# EAGLE design PhasedArrayReceiver (EAGLE 9.5.2)
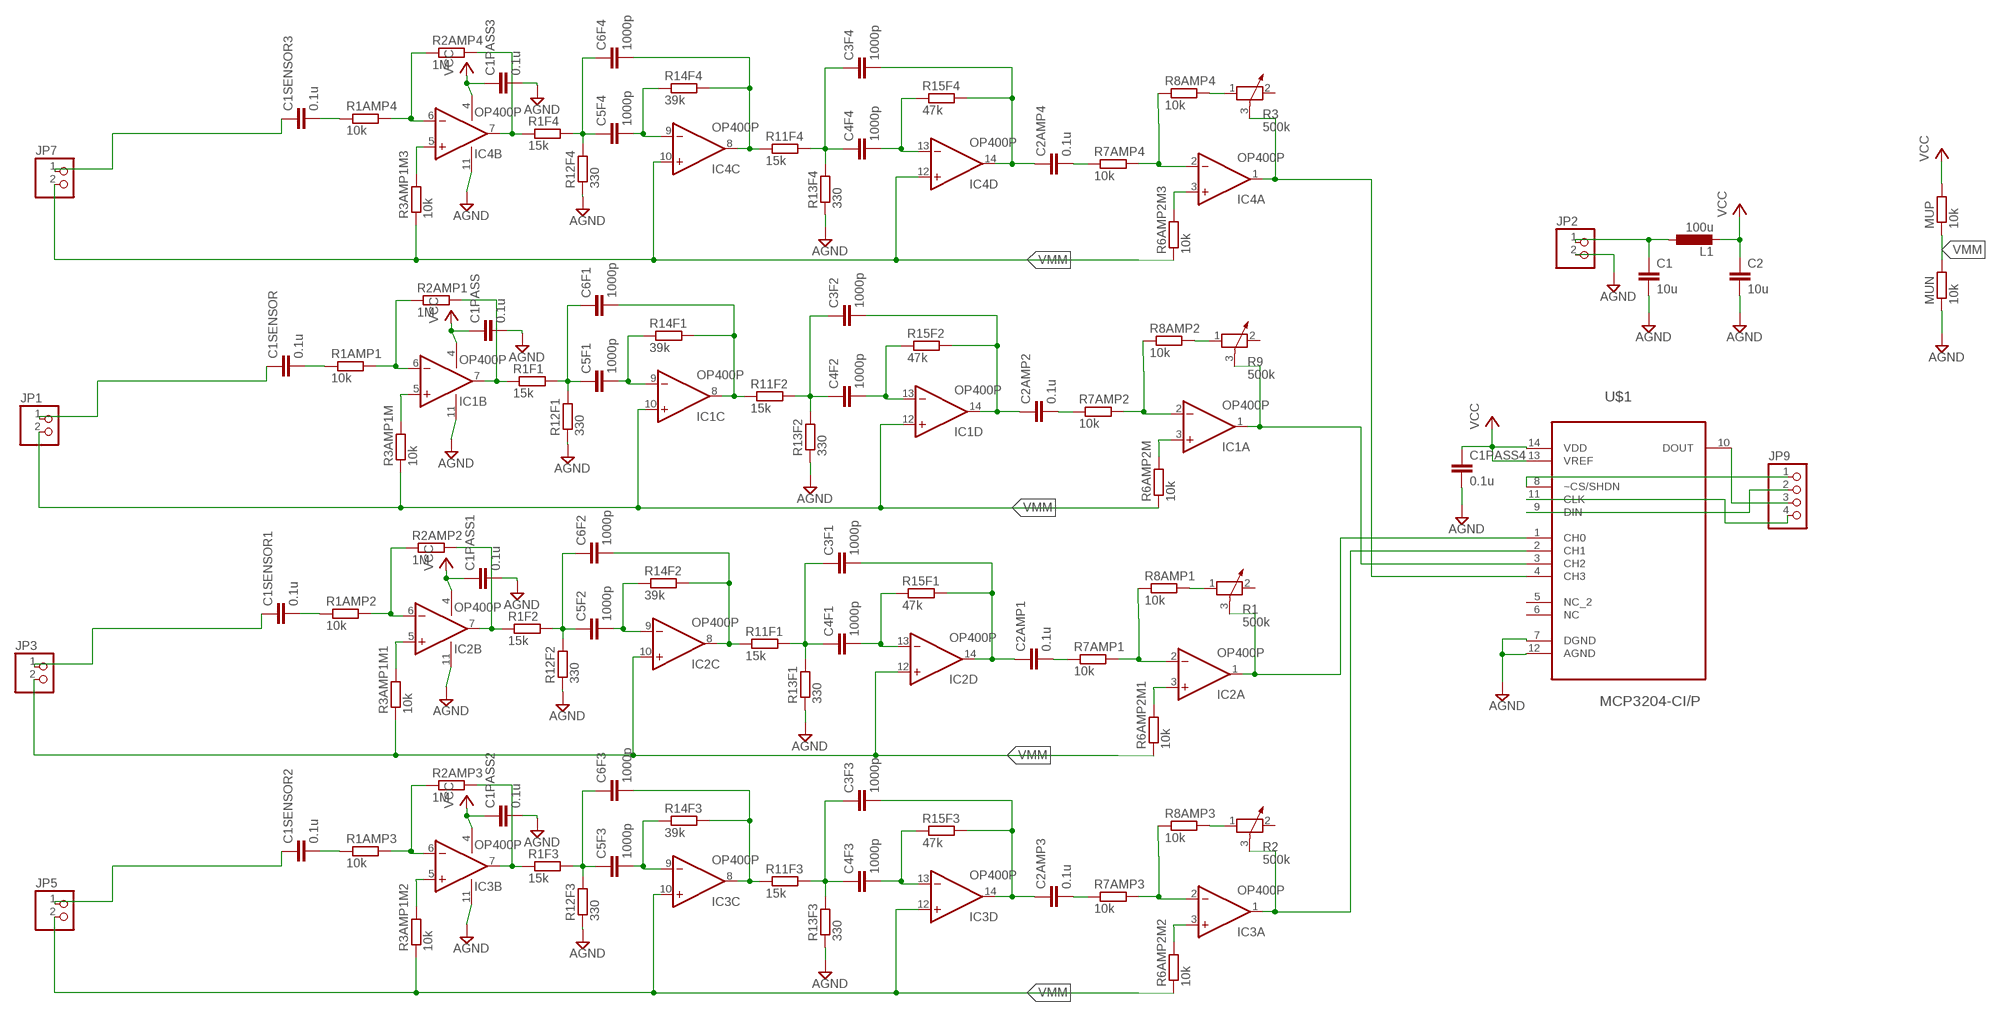
[diagram p0: schematic, sheet 1]

## Parts
C1  10u  C-EU025-024X044  [C025-024X044]
C1PASS  0.1u  C-EU025-024X044  [C025-024X044]
C1PASS1  0.1u  C-EU025-024X044  [C025-024X044]
C1PASS2  0.1u  C-EU025-024X044  [C025-024X044]
C1PASS3  0.1u  C-EU025-024X044  [C025-024X044]
C1PASS4  0.1u  C-EU025-024X044  [C025-024X044]
C1SENSOR  0.1u  C-EUC0603K  [C0603K]
C1SENSOR1  0.1u  C-EUC0603K  [C0603K]
C1SENSOR2  0.1u  C-EUC0603K  [C0603K]
C1SENSOR3  0.1u  C-EUC0603K  [C0603K]
C2  10u  C-EU025-024X044  [C025-024X044]
C2AMP1  0.1u  C-EUC0603K  [C0603K]
C2AMP2  0.1u  C-EUC0603K  [C0603K]
C2AMP3  0.1u  C-EUC0603K  [C0603K]
C2AMP4  0.1u  C-EUC0603K  [C0603K]
C3F1  1000p  C-EUC0603K  [C0603K]
C3F2  1000p  C-EUC0603K  [C0603K]
C3F3  1000p  C-EUC0603K  [C0603K]
C3F4  1000p  C-EUC0603K  [C0603K]
C4F1  1000p  C-EUC0603K  [C0603K]
C4F2  1000p  C-EUC0603K  [C0603K]
C4F3  1000p  C-EUC0603K  [C0603K]
C4F4  1000p  C-EUC0603K  [C0603K]
C5F1  1000p  C-EUC0603K  [C0603K]
C5F2  1000p  C-EUC0603K  [C0603K]
C5F3  1000p  C-EUC0603K  [C0603K]
C5F4  1000p  C-EUC0603K  [C0603K]
C6F1  1000p  C-EUC0603K  [C0603K]
C6F2  1000p  C-EUC0603K  [C0603K]
C6F3  1000p  C-EUC0603K  [C0603K]
C6F4  1000p  C-EUC0603K  [C0603K]
IC1  OP400P  [DIL14]
IC2  OP400P  [DIL14]
IC3  OP400P  [DIL14]
IC4  OP400P  [DIL14]
JP1  PINHD-1X2  [1X02]
JP2  PINHD-1X2  [1X02]
JP3  PINHD-1X2  [1X02]
JP5  PINHD-1X2  [1X02]
JP7  PINHD-1X2  [1X02]
JP9  PINHD-1X4  [1X04]
L1  100u  L-EU0207/7  [0207/7]
MUN  10k  R-EU_0207/7  [0207/7]
MUP  10k  R-EU_0207/7  [0207/7]
R1  500k  POTENTIOMETER_PT-10  [PT-10]
R1AMP1  10k  R-EU_R0603  [R0603]
R1AMP2  10k  R-EU_R0603  [R0603]
R1AMP3  10k  R-EU_R0603  [R0603]
R1AMP4  10k  R-EU_R0603  [R0603]
R1F1  15k  R-EU_0207/7  [0207/7]
R1F2  15k  R-EU_0207/7  [0207/7]
R1F3  15k  R-EU_0207/7  [0207/7]
R1F4  15k  R-EU_0207/7  [0207/7]
R2  500k  POTENTIOMETER_PT-10  [PT-10]
R2AMP1  1M  R-EU_R0603  [R0603]
R2AMP2  1M  R-EU_R0603  [R0603]
R2AMP3  1M  R-EU_R0603  [R0603]
R2AMP4  1M  R-EU_R0603  [R0603]
R3  500k  POTENTIOMETER_PT-10  [PT-10]
R3AMP1M  10k  R-EU_R0603  [R0603]
R3AMP1M1  10k  R-EU_R0603  [R0603]
R3AMP1M2  10k  R-EU_R0603  [R0603]
R3AMP1M3  10k  R-EU_R0603  [R0603]
R6AMP2M  10k  R-EU_R0603  [R0603]
R6AMP2M1  10k  R-EU_R0603  [R0603]
R6AMP2M2  10k  R-EU_R0603  [R0603]
R6AMP2M3  10k  R-EU_R0603  [R0603]
R7AMP1  10k  R-EU_R0603  [R0603]
R7AMP2  10k  R-EU_R0603  [R0603]
R7AMP3  10k  R-EU_R0603  [R0603]
R7AMP4  10k  R-EU_R0603  [R0603]
R8AMP1  10k  R-EU_R0603  [R0603]
R8AMP2  10k  R-EU_R0603  [R0603]
R8AMP3  10k  R-EU_R0603  [R0603]
R8AMP4  10k  R-EU_R0603  [R0603]
R9  500k  POTENTIOMETER_PT-10  [PT-10]
R11F1  15k  R-EU_R0603  [R0603]
R11F2  15k  R-EU_R0603  [R0603]
R11F3  15k  R-EU_R0603  [R0603]
R11F4  15k  R-EU_R0603  [R0603]
R12F1  330  R-EU_R0603  [R0603]
R12F2  330  R-EU_R0603  [R0603]
R12F3  330  R-EU_R0603  [R0603]
R12F4  330  R-EU_R0603  [R0603]
R13F1  330  R-EU_R0603  [R0603]
R13F2  330  R-EU_R0603  [R0603]
R13F3  330  R-EU_R0603  [R0603]
R13F4  330  R-EU_R0603  [R0603]
R14F1  39k  R-EU_0207/7  [0207/7]
R14F2  39k  R-EU_0207/7  [0207/7]
R14F3  39k  R-EU_0207/7  [0207/7]
R14F4  39k  R-EU_0207/7  [0207/7]
R15F1  47k  R-EU_0207/7  [0207/7]
R15F2  47k  R-EU_0207/7  [0207/7]
R15F3  47k  R-EU_0207/7  [0207/7]
R15F4  47k  R-EU_0207/7  [0207/7]
U$1  MCP3204-CI/P  [DIP254P762X432-14]

## Nets
AGND [power]: C1.2 C1PASS1.2 C1PASS2.2 C1PASS3.2 C1PASS4.2 C1PASS.2 C2.2 IC1.11(P:V-) IC2.11(P:V-) IC3.11(P:V-) IC4.11(P:V-) JP2.2 MUN.1 R12F1.1 R12F2.1 R12F3.1 R12F4.1 R13F1.1 R13F2.1 R13F3.1 R13F4.1 U$1.7(DGND) U$1.12(AGND)
N$1: IC1.6(B:-IN) R1AMP1.2 R2AMP1.1
N$2: IC1.5(B:+IN) R3AMP1M.2
N$3: IC1.7(B:OUT) R1F1.1 R2AMP1.2
N$4: IC1.2(A:-IN) R7AMP2.2 R8AMP2.1
N$5: IC2.6(B:-IN) R1AMP2.2 R2AMP2.1
N$6: C1SENSOR.1 JP1.1
N$7: IC1.3(A:+IN) R6AMP2M.2
N$8: C1SENSOR.2 R1AMP1.1
N$9: C2AMP2.2 R7AMP2.1
N$10: R8AMP2.2 R9.1
N$11: IC1.1(A:OUT) R9.3 U$1.3(CH2)
N$12: C2AMP2.1 C3F2.2 IC1.14(D:OUT) R15F2.2
N$13: C5F1.2 IC1.9(C:-IN) R14F1.1
N$14: C4F2.2 IC1.13(D:-IN) R15F2.1
N$15: C3F2.1 C4F2.1 R11F2.2 R13F2.2
N$16: C6F1.2 IC1.8(C:OUT) R11F2.1 R14F1.2
N$17: C5F1.1 C6F1.1 R1F1.2 R12F1.2
N$18: IC2.7(B:OUT) R1F2.1 R2AMP2.2
N$19: IC2.2(A:-IN) R7AMP1.2 R8AMP1.1
N$20: IC2.3(A:+IN) R6AMP2M1.2
N$21: C1SENSOR1.2 R1AMP2.1
N$22: C2AMP1.2 R7AMP1.1
N$23: R1.1 R8AMP1.2
N$24: C2AMP1.1 C3F1.2 IC2.14(D:OUT) R15F1.2
N$25: C5F2.2 IC2.9(C:-IN) R14F2.1
N$26: C4F1.2 IC2.13(D:-IN) R15F1.1
N$27: C3F1.1 C4F1.1 R11F1.2 R13F1.2
N$28: C6F2.2 IC2.8(C:OUT) R11F1.1 R14F2.2
N$29: C5F2.1 C6F2.1 R1F2.2 R12F2.2
N$30: IC2.5(B:+IN) R3AMP1M1.2
N$31: C1SENSOR1.1 JP3.1
N$32: IC2.1(A:OUT) R1.3 U$1.1(CH0)
N$33: IC3.6(B:-IN) R1AMP3.2 R2AMP3.1
N$34: IC3.7(B:OUT) R1F3.1 R2AMP3.2
N$35: IC3.2(A:-IN) R7AMP3.2 R8AMP3.1
N$36: IC3.3(A:+IN) R6AMP2M2.2
N$37: C1SENSOR2.2 R1AMP3.1
N$38: C2AMP3.2 R7AMP3.1
N$39: R2.1 R8AMP3.2
N$40: C2AMP3.1 C3F3.2 IC3.14(D:OUT) R15F3.2
N$41: C5F3.2 IC3.9(C:-IN) R14F3.1
N$42: C4F3.2 IC3.13(D:-IN) R15F3.1
N$43: C3F3.1 C4F3.1 R11F3.2 R13F3.2
N$44: C6F3.2 IC3.8(C:OUT) R11F3.1 R14F3.2
N$45: C5F3.1 C6F3.1 R1F3.2 R12F3.2
N$46: IC3.5(B:+IN) R3AMP1M2.2
N$47: C1SENSOR2.1 JP5.1
N$48: IC3.1(A:OUT) R2.3 U$1.2(CH1)
N$49: IC4.6(B:-IN) R1AMP4.2 R2AMP4.1
N$50: IC4.7(B:OUT) R1F4.1 R2AMP4.2
N$51: IC4.2(A:-IN) R7AMP4.2 R8AMP4.1
N$52: IC4.3(A:+IN) R6AMP2M3.2
N$53: C1SENSOR3.2 R1AMP4.1
N$54: C2AMP4.2 R7AMP4.1
N$55: R3.1 R8AMP4.2
N$56: C2AMP4.1 C3F4.2 IC4.14(D:OUT) R15F4.2
N$57: C5F4.2 IC4.9(C:-IN) R14F4.1
N$58: C4F4.2 IC4.13(D:-IN) R15F4.1
N$59: C3F4.1 C4F4.1 R11F4.2 R13F4.2
N$60: C6F4.2 IC4.8(C:OUT) R11F4.1 R14F4.2
N$61: C5F4.1 C6F4.1 R1F4.2 R12F4.2
N$62: IC4.5(B:+IN) R3AMP1M3.2
N$63: C1SENSOR3.1 JP7.1
N$64: IC4.1(A:OUT) R3.3 U$1.4(CH3)
N$65: JP9.1 U$1.8(~CS/SHDN)
N$66: JP9.2 U$1.9(DIN)
N$67: JP9.3 U$1.10(DOUT)
N$68: JP9.4 U$1.11(CLK)
N$69: C1.1 JP2.1 L1.1
VCC [power]: C1PASS1.1 C1PASS2.1 C1PASS3.1 C1PASS4.1 C1PASS.1 C2.1 IC1.4(P:V+) IC2.4(P:V+) IC3.4(P:V+) IC4.4(P:V+) L1.2 MUP.2 U$1.13(VREF) U$1.14(VDD)
VMM [power]: IC1.10(C:+IN) IC1.12(D:+IN) IC2.10(C:+IN) IC2.12(D:+IN) IC3.10(C:+IN) IC3.12(D:+IN) IC4.10(C:+IN) IC4.12(D:+IN) JP1.2 JP3.2 JP5.2 JP7.2 MUN.2 MUP.1 R3AMP1M1.1 R3AMP1M2.1 R3AMP1M3.1 R3AMP1M.1 R6AMP2M1.1 R6AMP2M2.1 R6AMP2M3.1 R6AMP2M.1
Unconnected: R1.2 R2.2 R3.2 R9.2 U$1.5(NC_2) U$1.6(NC)

## Library data of the parts
C1 C1PASS C1PASS1-C1PASS4 C1SENSOR C1SENSOR1-C1SENSOR3 C2 C2AMP1-C2AMP4 C3F1-C3F4 C4F1-C4F4 C5F1-C5F4 C6F1-C6F4 = rcl:C-EU: CAPACITOR, European symbol; SPICEPREFIX: C
IC1-IC4 = linear:OP400: OP AMP
JP1-JP3 JP5 JP7 = pinhead:PINHD-1X2: PIN HEADER
JP9 = pinhead:PINHD-1X4: PIN HEADER
L1 = rcl:L-EU: INDUCTOR, European symbol; SPICEPREFIX: L
MUN MUP R1AMP1-R1AMP4 R1F1-R1F4 R2AMP1-R2AMP4 R3AMP1M R3AMP1M1-R3AMP1M3 R6AMP2M R6AMP2M1-R6AMP2M3 R7AMP1-R7AMP4 R8AMP1-R8AMP4 R11F1-R11F4 R12F1-R12F4 R13F1-R13F4 R14F1-R14F4 R15F1-R15F4 = rcl:R-EU_: RESISTOR, European symbol; SPICEPREFIX: R
R1-R3 R9 = rcl:POTENTIOMETER_: Potentiometer; SPICEMODEL: POT; SPICEPREFIX: X
U$1 = MCP3204-CI_P:MCP3204-CI/P: A/D Converters; AVAILABILITY: Unavailable; DESCRIPTION: 12 Bit Analog to Digital Converter 2, 4 Input 1 SAR 14-PDIP; MF: Microchip; MP: MCP3204-CI/P; PACKAGE: DIP-14 Microchip; PRICE: None

## Net classes
0 default: width 0.61 mm, clearance 0.203 mm
1 power: width 0.914 mm, clearance 0.254 mm

## Board
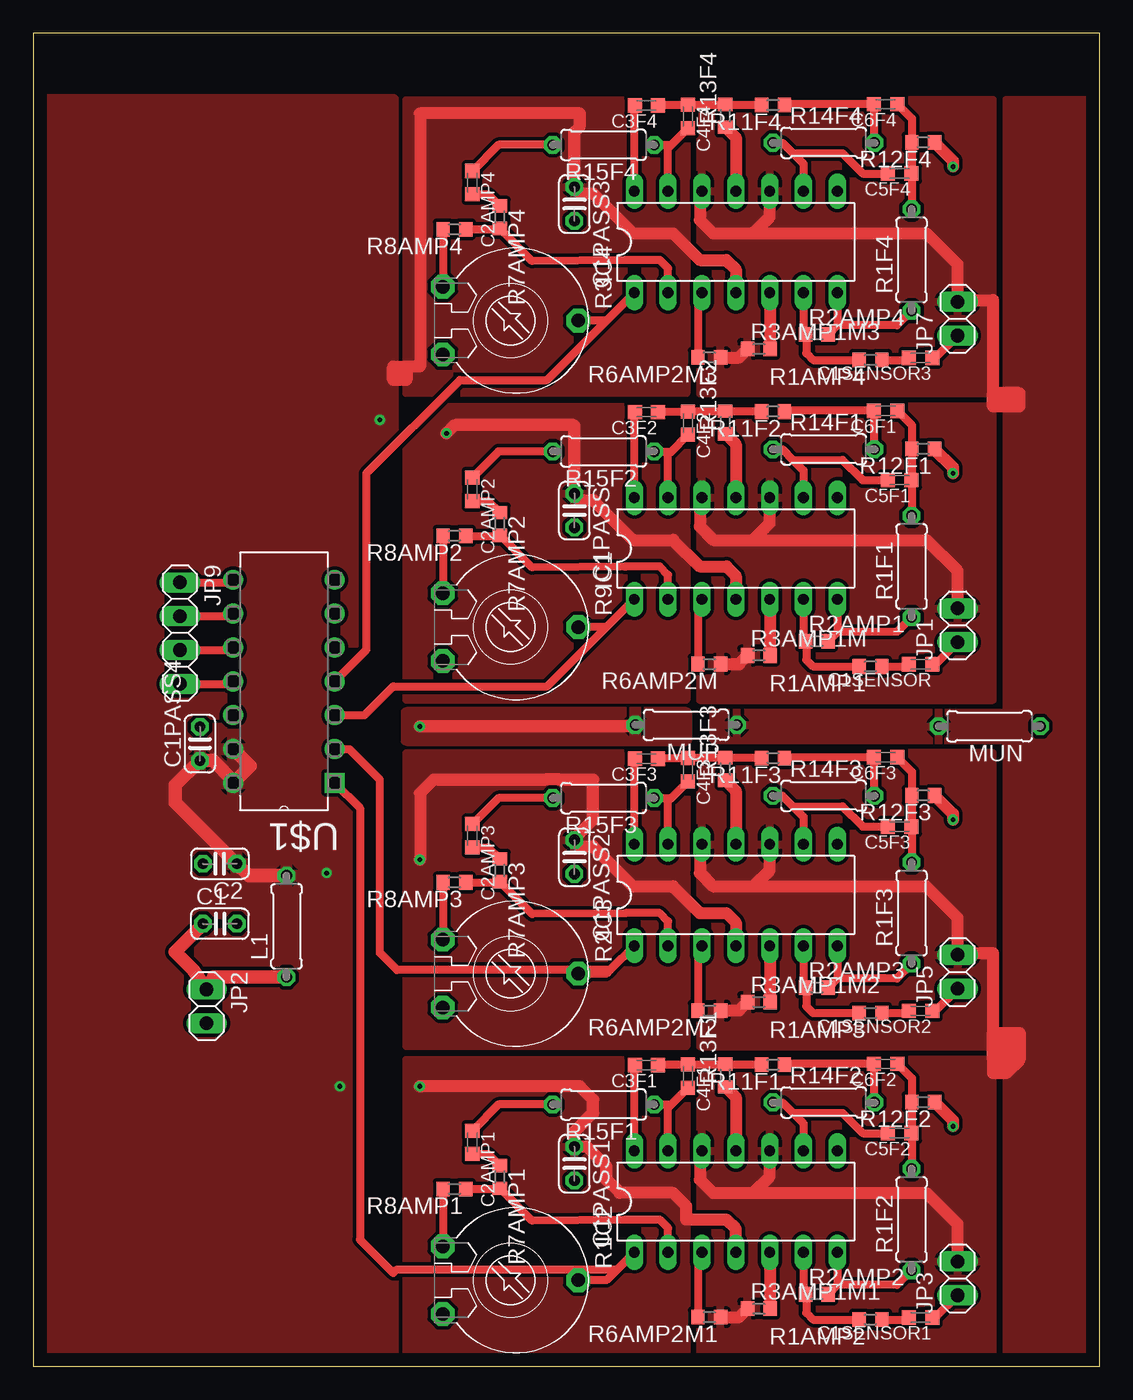
[diagram p1: board, top side]
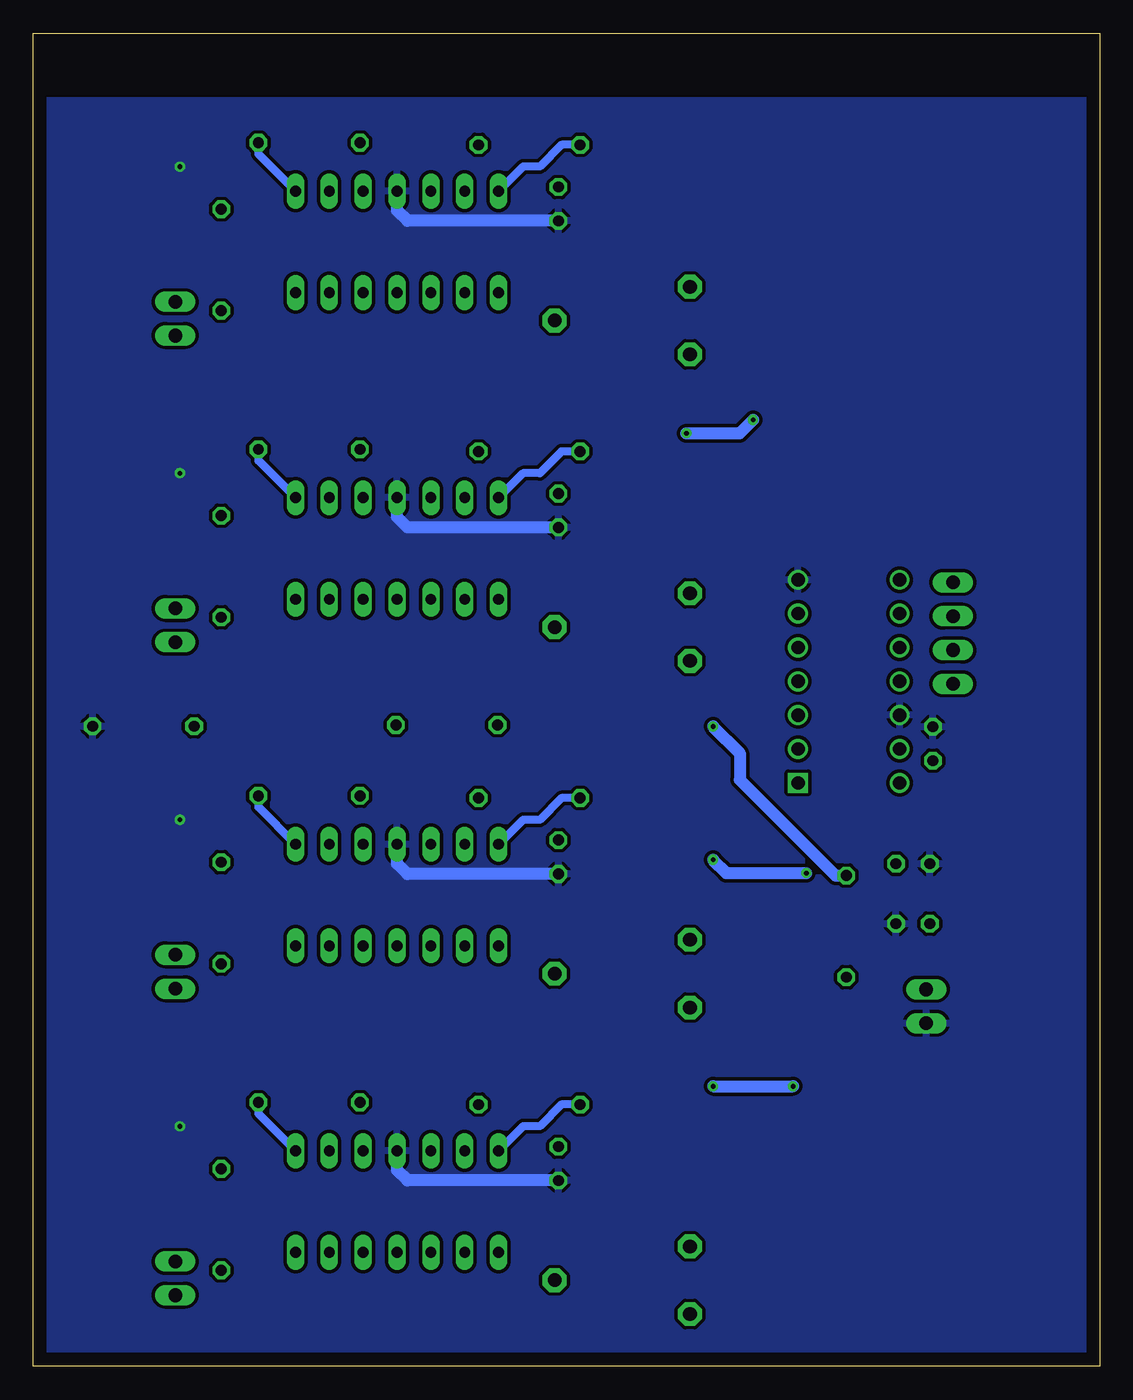
[diagram p2: board, bottom side, seen from below]

Size 80 x 100 mm. Coordinates in mm from the lower left corner, seen from the top.
Outline: 0,0 80,0 80,100 0,100 0,0
Copper layers (1*16): Top 0.035mm / dielectric 1.5mm / Bottom 0.035mm
Design rules "default": minimum track width 6mil, minimum drill 0.35mm, track to track 6mil, track to pad 6mil, pad to pad 6mil, via to via 6mil, smd to smd 6mil, copper to edge 40mil, drill to drill 6mil, minimum pad ring 10mil, minimum via ring 8mil, stop-mask expansion 4mil, vias tented up to drill 0mil, thermal gap 10mil

### Footprints (pad centres in the part's own frame; a part is rotated, then mirrored left to right if it is on the bottom)
C025-024X044 = drill 0.813 octagon: 1 -1.27,0; 2 1.27,0
C0603K = smd 1.05 x 1.08: 1 -0.875,0; 2 0.875,0
DIL14 = drill 0.813 long: 1 -7.62,-3.81; 2 -5.08,-3.81; 3 -2.54,-3.81; 4 0,-3.81; 5 2.54,-3.81; 6 5.08,-3.81; 7 7.62,-3.81; 8 7.62,3.81; 9 5.08,3.81; 10 2.54,3.81; 11 0,3.81; 12 -2.54,3.81; 13 -5.08,3.81; 14 -7.62,3.81
1X02 = drill 1.016 long: 1 -1.27,0; 2 1.27,0
1X04 = drill 1.016 long: 1 -3.81,0; 2 -1.27,0; 3 1.27,0; 4 3.81,0
0207/7 = drill 0.813 octagon: 1 -3.81,0; 2 3.81,0
PT-10 = drill 1.016 pad 1.778 octagon: 1 -2.54,-5.08; 2 2.54,-5.08; 3 0,5.08
R0603 = smd 1 x 1.1: 1 -0.85,0; 2 0.85,0
DIP254P762X432-14 = drill 0.991 square: 1 -7.62,15.24 | drill 0.991: 2 -7.62,12.7; 3 -7.62,10.16; 4 -7.62,7.62; 5 -7.62,5.08; 6 -7.62,2.54; 7 -7.62,0; 8 0,0; 9 0,2.54; 10 0,5.08; 11 0,7.62; 12 0,10.16; 13 0,12.7; 14 0,15.24

### Placement (x,y rotation side)
C1  14,33.2 0 top
C1PASS  40.6,64.2 270 top
C1PASS1  40.6,15.2 270 top
C1PASS2  40.6,38.2 270 top
C1PASS3  40.6,87.2 270 top
C1PASS4  12.5,46.7 90 top
C1SENSOR  66.58,52.66 180 top
C1SENSOR1  66.58,3.66 180 top
C1SENSOR2  66.58,26.66 180 top
C1SENSOR3  66.58,75.66 180 top
C2  14,37.7 180 top
C2AMP1  32.94,16.8 270 top
C2AMP2  32.94,65.8 270 top
C2AMP3  32.94,39.8 270 top
C2AMP4  32.94,88.8 270 top
C3F1  46.01,22.58 180 top
C3F2  46.01,71.58 180 top
C3F3  46.01,45.58 180 top
C3F4  46.01,94.58 180 top
C4F1  49.12,21.76 270 top
C4F2  49.12,70.76 270 top
C4F3  49.12,44.76 270 top
C4F4  49.12,93.76 270 top
C5F1  65.01,66.48 180 top
C5F2  65.01,17.48 180 top
C5F3  65.01,40.48 180 top
C5F4  65.01,89.48 180 top
C6F1  63.96,71.68 180 top
C6F2  63.96,22.68 180 top
C6F3  63.96,45.68 180 top
C6F4  63.96,94.68 180 top
IC1  52.71,61.35 0 top
IC2  52.71,12.35 0 top
IC3  52.71,35.35 0 top
IC4  52.71,84.35 0 top
JP1  69.35,55.59 90 top
JP2  13,27 270 top
JP3  69.35,6.59 90 top
JP5  69.35,29.59 90 top
JP7  69.35,78.59 90 top
JP9  11,55 270 top
L1  19,33 90 top
MUN  71.74,48.01 180 top
MUP  48.98,48.11 180 top
R1  35.81,6.45 270 top
R1AMP1  62.82,52.5 180 top
R1AMP2  62.82,3.5 180 top
R1AMP3  62.82,26.5 180 top
R1AMP4  62.82,75.5 180 top
R1F1  65.9,60 90 top
R1F2  65.9,11 90 top
R1F3  65.9,34 90 top
R1F4  65.9,83 90 top
R2  35.81,29.45 270 top
R2AMP1  58.79,54.4 0 top
R2AMP2  58.79,5.4 0 top
R2AMP3  58.79,28.4 0 top
R2AMP4  58.79,77.4 0 top
R3  35.81,78.45 270 top
R3AMP1M  54.44,53.32 0 top
R3AMP1M1  54.44,4.32 0 top
R3AMP1M2  54.44,27.32 0 top
R3AMP1M3  54.44,76.32 0 top
R6AMP2M  50.72,52.68 180 top
R6AMP2M1  50.72,3.68 180 top
R6AMP2M2  50.72,26.68 180 top
R6AMP2M3  50.72,75.68 180 top
R7AMP1  35,14.2 270 top
R7AMP2  35,63.2 270 top
R7AMP3  35,37.2 270 top
R7AMP4  35,86.2 270 top
R8AMP1  31.59,13.3 180 top
R8AMP2  31.59,62.3 180 top
R8AMP3  31.59,36.3 180 top
R8AMP4  31.59,85.3 180 top
R9  35.81,55.45 270 top
R11F1  55.51,22.62 180 top
R11F2  55.51,71.62 180 top
R11F3  55.51,45.62 180 top
R11F4  55.51,94.62 180 top
R12F1  66.77,68.82 180 top
R12F2  66.77,19.82 180 top
R12F3  66.77,42.82 180 top
R12F4  66.77,91.82 180 top
R13F1  51.92,21.81 90 top
R13F2  51.92,70.81 90 top
R13F3  51.92,44.81 90 top
R13F4  51.92,93.81 90 top
R14F1  59.3,68.79 0 top
R14F2  59.3,19.79 0 top
R14F3  59.3,42.79 0 top
R14F4  59.3,91.79 0 top
R15F1  42.78,19.63 180 top
R15F2  42.78,68.63 180 top
R15F3  42.78,42.63 180 top
R15F4  42.78,91.63 180 top
U$1  15,59 180 top

### Tracks (layer width: path | path; a pad name or v marks a point on that pad's centre or on a via)
AGND  (via drill 0.35)
  Top 0.914: R13F2.1 52.71,69.17 IC1.11 | R12F1.1 69,67.44 v69,67 | R13F3.1 52.71,43.17 IC3.11 | R12F3.1 69,41.44 v69,41 | R13F1.1 52.71,20.17 IC2.11 | R12F2.1 69,18.44 v69,18 | R13F4.1 52.71,92.17 IC4.11 | R12F4.1 69,90.44 v69,90
  Bottom 0.914: C1PASS.2 51.93,62.93 52.71,63.71 IC1.11 | C1PASS2.2 51.93,36.93 52.71,37.71 IC3.11 | C1PASS1.2 51.93,13.93 52.71,14.71 IC2.11 | C1PASS3.2 51.93,85.93 52.71,86.71 IC4.11
  pour Bottom: 0,95 0,0 80,0 80,95
N$1
  Top 0.61: IC1.6 57.79,54.55 R2AMP1.1 58,54.34 58,53 58.5,52.5 R1AMP1.2
N$2
  Top 0.914: IC1.5 55.25,53.36 R3AMP1M.2
N$3
  Top 0.61: IC1.7 60.33,55.09 | 60.33,55.09 R2AMP1.2 | R1F1.1 64.8,55.09 60.33,55.09
N$4
  Top 0.61: IC1.2 47.63,59.37 47,60 44.44,60 44.42,59.98 37.43,59.92 R7AMP2.2 34.95,62.3 R8AMP2.1
N$5
  Top 0.61: IC2.6 57.79,5.55 R2AMP2.1 58,5.34 58,4 58.5,3.5 R1AMP2.2
N$6
  Top 0.61: C1SENSOR.1 67.69,52.66 JP1.1
N$7
  Top 0.61: IC1.3 49.87,57.24 R6AMP2M.2
N$8
  Top 0.61: R1AMP1.1 65.55,52.5 C1SENSOR.2
N$9
  Top 0.61: C2AMP2.2 34.12,64.92 R7AMP2.1
N$10
  Top 0.61: R8AMP2.2 R9.1
N$11
  Top 0.61: IC1.1 43,55.45 | 43,55.45 R9.3 | 43,55.45 38.55,51 27,51 24.84,48.84 U$1.3
N$12
  Top 0.61: R15F2.2 34.9,68.63 C2AMP2.1 | IC1.14 45.09,71.53 C3F2.2
  Bottom 0.61: R15F2.2 40.37,68.63 42,67 43.25,67 IC1.14
N$13
  Top 0.61: R14F1.1 56.21,68.79 57,68 | IC1.9 57.79,67.21 57,68 | 57,68 60.72,68 62.23,66.48 C5F1.2
N$14
  Top 0.61: R15F2.1 47.87,68.63 | 47.87,68.63 C4F2.2 | IC1.13 47.63,68.39 47.87,68.63
N$15
  Top 0.61: C3F2.1 46.94,71.64 C4F2.1 49.15,71.66 R13F2.2 54.62,71.66 R11F2.2
N$16
  Top 0.61: R11F2.1 56.42,71.68 C6F1.2 63.09,68.81 R14F1.2
  Bottom 0.61: IC1.8 63.11,67.94 R14F1.2
N$17
  Top 0.61: C6F1.1 65.92,70.59 R12F1.2 65.92,66.52 C5F1.1 65.9,66.47 R1F1.2
N$18
  Top 0.61: IC2.7 60.33,6.09 | 60.33,6.09 R2AMP2.2 | R1F2.1 64.8,6.09 60.33,6.09
N$19
  Top 0.61: IC2.2 47.63,10.37 47,11 44.44,11 44.42,10.98 37.43,10.92 R7AMP1.2 34.95,13.3 R8AMP1.1
N$20
  Top 0.61: IC2.3 49.87,8.24 R6AMP2M1.2
N$21
  Top 0.61: R1AMP2.1 65.55,3.5 C1SENSOR1.2
N$22
  Top 0.61: C2AMP1.2 34.12,15.93 R7AMP1.1
N$23
  Top 0.61: R8AMP1.2 R1.1
N$24
  Top 0.61: R15F1.2 34.9,19.63 C2AMP1.1 | IC2.14 45.09,22.54 C3F1.2
  Bottom 0.61: R15F1.2 40.37,19.63 42,18 43.25,18 IC2.14
N$25
  Top 0.61: R14F2.1 56.21,19.79 57,19 | IC2.9 57.79,18.21 57,19 | 57,19 60.72,19 62.23,17.48 C5F2.2
N$26
  Top 0.61: R15F1.1 47.87,19.63 | 47.87,19.63 C4F1.2 | IC2.13 47.63,19.39 47.87,19.63
N$27
  Top 0.61: C3F1.1 46.94,22.64 C4F1.1 49.15,22.66 R13F1.2 54.62,22.66 R11F1.2
N$28
  Top 0.61: R11F1.1 56.42,22.68 C6F2.2 63.09,19.82 R14F2.2
  Bottom 0.61: IC2.8 63.11,18.94 R14F2.2
N$29
  Top 0.61: C6F2.1 65.92,21.59 R12F2.2 65.92,17.52 C5F2.1 65.9,17.46 R1F2.2
N$30
  Top 0.914: IC2.5 55.25,4.36 R3AMP1M1.2
N$31
  Top 0.61: C1SENSOR1.1 67.69,3.66 JP3.1
N$32
  Top 0.61: IC2.1 43.77,7.22 | 43.77,7.22 43,6.45 R1.3 | 43.77,7.22 27.23,7.22 27,7 24.5,9.5 24.5,41.88 U$1.1
N$33
  Top 0.61: IC3.6 57.79,28.55 R2AMP3.1 58,28.34 58,27 58.5,26.5 R1AMP3.2
N$34
  Top 0.61: IC3.7 60.33,29.09 | 60.33,29.09 R2AMP3.2 | R1F3.1 64.8,29.09 60.33,29.09
N$35
  Top 0.61: IC3.2 47.63,33.37 47,34 44.44,34 44.42,33.98 37.43,33.92 R7AMP3.2 34.95,36.3 R8AMP3.1
N$36
  Top 0.61: IC3.3 49.87,31.24 R6AMP2M2.2
N$37
  Top 0.61: R1AMP3.1 65.55,26.5 C1SENSOR2.2
N$38
  Top 0.61: C2AMP3.2 34.12,38.92 R7AMP3.1
N$39
  Top 0.61: R8AMP3.2 R2.1
N$40
  Top 0.61: R15F3.2 34.9,42.63 C2AMP3.1 | IC3.14 45.09,45.53 C3F3.2
  Bottom 0.61: R15F3.2 40.37,42.63 42,41 43.25,41 IC3.14
N$41
  Top 0.61: R14F3.1 56.21,42.79 57,42 | IC3.9 57.79,41.21 57,42 | 57,42 60.72,42 62.23,40.48 C5F3.2
N$42
  Top 0.61: R15F3.1 47.87,42.63 | 47.87,42.63 C4F3.2 | IC3.13 47.63,42.4 47.87,42.63
N$43
  Top 0.61: C3F3.1 46.94,45.63 C4F3.1 49.15,45.66 R13F3.2 54.62,45.66 R11F3.2
N$44
  Top 0.61: R11F3.1 56.42,45.68 C6F3.2 63.09,42.81 R14F3.2
  Bottom 0.61: IC3.8 63.11,41.94 R14F3.2
N$45
  Top 0.61: C6F3.1 65.92,44.59 R12F3.2 65.92,40.52 C5F3.1 65.9,40.47 R1F3.2
N$46
  Top 0.914: IC3.5 55.25,27.36 R3AMP1M2.2
N$47
  Top 0.61: C1SENSOR2.1 67.69,26.66 JP5.1
N$48
  Top 0.61: IC3.1 43.27,29.73 | 43.27,29.73 43,29.45 R2.3 | 43.27,29.73 27.27,29.73 26,31 26,44 23.7,46.3 U$1.2
N$49
  Top 0.61: IC4.6 57.79,77.55 R2AMP4.1 58,77.34 58,76 58.5,75.5 R1AMP4.2
N$50
  Top 0.61: IC4.7 60.33,78.09 | 60.33,78.09 R2AMP4.2 | R1F4.1 64.8,78.09 60.33,78.09
N$51
  Top 0.61: IC4.2 47.63,82.37 47,83 44.44,83 44.42,82.98 37.43,82.92 R7AMP4.2 34.95,85.3 R8AMP4.1
N$52
  Top 0.61: IC4.3 49.87,80.24 R6AMP2M3.2
N$53
  Top 0.61: R1AMP4.1 65.55,75.5 C1SENSOR3.2
N$54
  Top 0.61: C2AMP4.2 34.12,87.92 R7AMP4.1
N$55
  Top 0.61: R8AMP4.2 R3.1
N$56
  Top 0.61: R15F4.2 34.9,91.63 C2AMP4.1 | IC4.14 45.09,94.53 C3F4.2
  Bottom 0.61: R15F4.2 40.37,91.63 42,90 43.25,90 IC4.14
N$57
  Top 0.61: R14F4.1 56.21,91.79 57,91 | IC4.9 57.79,90.21 57,91 | 57,91 60.72,91 62.23,89.48 C5F4.2
N$58
  Top 0.61: R15F4.1 47.87,91.63 | 47.87,91.63 C4F4.2 | IC4.13 47.63,91.39 47.87,91.63
N$59
  Top 0.61: C3F4.1 46.94,94.64 C4F4.1 49.15,94.66 R13F4.2 54.62,94.66 R11F4.2
N$60
  Top 0.61: R11F4.1 56.42,94.68 C6F4.2 63.09,91.81 R14F4.2
  Bottom 0.61: IC4.8 63.11,90.94 R14F4.2
N$61
  Top 0.61: C6F4.1 65.92,93.59 R12F4.2 65.92,89.52 C5F4.1 65.9,89.47 R1F4.2
N$62
  Top 0.914: IC4.5 55.25,76.36 R3AMP1M3.2
N$63
  Top 0.61: C1SENSOR3.1 67.69,75.66 JP7.1
N$64
  Top 0.61: IC4.1 43,78.45 | 43,78.45 R3.3 | 43,78.45 38.55,74 32,74 25,67 25,53.76 U$1.4
N$65
  Top 0.61: JP9.1 15,58.81 U$1.8
N$66
  Top 0.61: JP9.2 14.81,56.27 U$1.9
N$67
  Top 0.61: JP9.3 14.81,53.73 U$1.10
N$68
  Top 0.61: JP9.4 14.81,51.19 U$1.11
N$69
  Top 1.016: L1.1 13.54,29.19 JP2.1 12,29.73 10.63,31.1 C1.1
VCC  (via drill 0.35)
  Top 0.914: IC1.4 52.71,59.3 52.01,60 50,60 48,62 45,62 42,65 41.07,65 C1PASS.1 40.6,70.6 31.6,70.6 v31,70 | 28,75 29,75 29,94 41,94 41,93 40.6,92.6 C1PASS3.1 41.07,88 42,88 45,85 48,85 50,83 52,83 52.71,82.29 IC4.4 | 28,75 27,75 27,74 | 27,74 28,74 28,75 | 28,75 27,74 | v29,21 38.4,21 41,21 42,20 42,19 40.6,17.6 C1PASS1.1 41.53,16.47 43,15 43,14 44,13 48,13 49,12 49,11 52,11 52.71,10.29 IC2.4 | v29,38 29,43 30,44 38.4,44 39.54,44 42,44 42,41 40.6,39.6 C1PASS2.1 41.07,39 42,39 45,36 48,36 50,34 52,34 52.71,33.29 IC3.4 | MUP.2 45.06,48 v29,48
  Top 1.016: L1.2 16.16,36.81 C2.1 10.66,42.31 10.66,43.59 C1PASS4.1 13.5,45.43 15.09,43.84 16.27,45.03 U$1.13
  Bottom 0.914: v31,70 27,70 v26,71 | v29,21 v23,21 | v29,38 28,37 v22,37 | v29,48 27,46 27,44 19.81,36.81 L1.2
  pour Top: 28,72 49,72 49,50 28,50
  pour Top: 28,46 49,46 49,24 28,24
  pour Top: 28,23 49,23 49,1 28,1
  pour Top: 28,95 49,95 49,73 28,73
  pour Top: 1,1 27,1 27,95 1,95
  pour Top: 49,49 28,49 28,47 49,47
VMM
  Top 0.914: IC1.12 50,64.99 50,63 51,62 54,62 | 54,62 55.25,63.25 IC1.10 | 54,62 67,62 69.35,59.65 JP1.2 | R6AMP2M.1 52.95,52.68 R3AMP1M.1 | IC3.12 50,38.99 50,37 51,36 54,36 | 54,36 55.25,37.25 IC3.10 | 54,36 67,36 69.35,33.65 JP5.2 69.49,31 72,31 72,25 | R6AMP2M2.1 52.95,26.68 R3AMP1M2.1 | IC2.12 50,15.99 50,14 51,13 54,13 | 54,13 55.25,14.25 IC2.10 | 54,13 67,13 69.35,10.65 JP3.2 | R6AMP2M1.1 52.95,3.68 R3AMP1M1.1 | IC4.12 50,87.99 50,86 51,85 54,85 | 54,85 55.25,86.25 IC4.10 | 54,85 67,85 69.35,82.65 JP7.2 69.49,80 72,80 72,73 | R6AMP2M3.1 52.95,75.68 R3AMP1M3.1 | 73,73 72,73 | 74,72 73,72 | 73,72 72,72 72,73 | 73,73 74,72 | 74,72 74,73 73,73 | 72,73 73,72 | 72,25 74,25 74,24 | 74,24 74,23 | 74,23 73,23 | 73,23 72,23 | 72,23 72,24 | 72,25 72,24 | 72,25 73,25 74,24 | 74,24 73,24 | 73,24 72,25 | 72,24 72,25 | 72,23 72,24 | 73,23 72,23 | 74,23 73,23 | 74,24 74,23 | 73,24 74,24 | 72,24 73,24 | 72,24 72,23 | 72,23 73,24 | 73,24 74,23 | 74,23 72,23 | 72,23 72,22 | 72,22 73,22 74,23 | 74,23 74,24 | 74,24 72,22
  pour Top: 72,50 72,72 50,72 50,50
  pour Top: 72,24 72,46 50,46 50,24
  pour Top: 72,1 72,23 50,23 50,1
  pour Top: 72,73 72,95 50,95 50,73
  pour Top: 51,49 51,47 73,47 73,1 79,1 79,95 73,95 73,49